# Altium schematic sheet POWER.SchDoc: POWER
size A4; Author: Gabriel; Organization: Altium Limited; Address1: L3, 12a Rodborough Rd; Address2: Frenchs Forest; Address3: NSW; Address4: Australia 2086; SheetNumber: 1; SheetTotal: 1; Subtitle: XDRONE
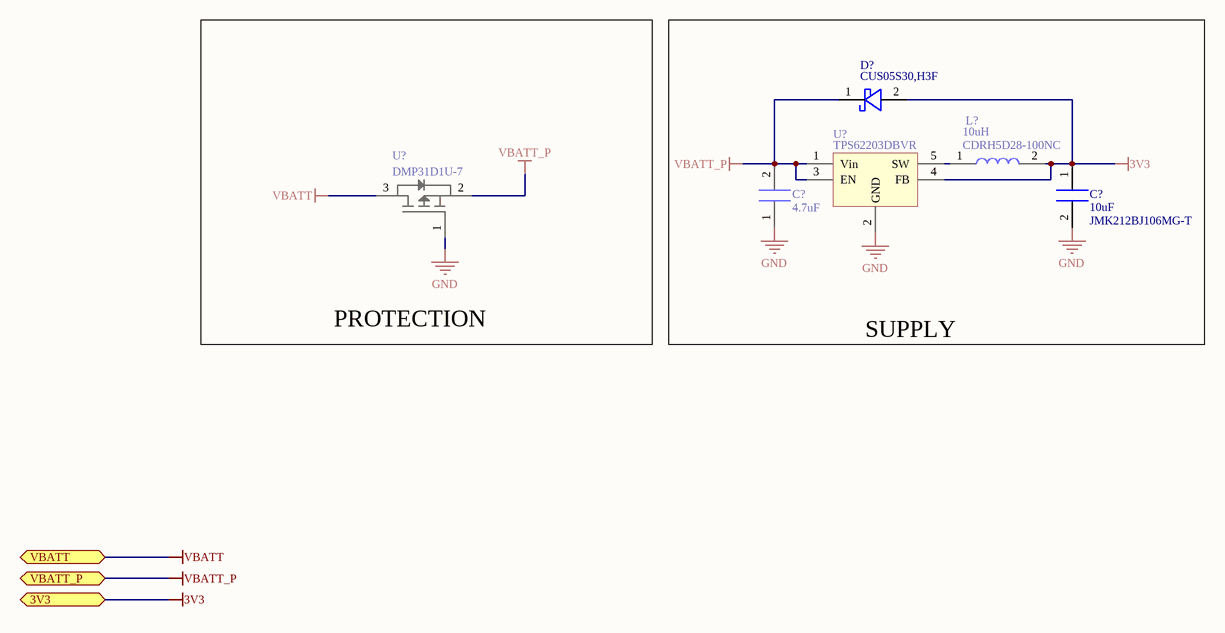
[diagram p0: POWER.SchDoc]

## Parts
(Parts that share a designator on the sheet are numbered #1, #2 ... from top to bottom, then left to right.)
C?#1  value 4.7uF  [CAP_0805]  (hidden comment: 4.7uF_10%_16V_0805_X7R_GRM21BR71C475KE51L)
C?#2  value 10uF  MANUFACTURER REFERENCE: JMK212BJ106MG-T  [CAP_0805]  (hidden comment: 10uF_20%_6.3V_0805_X5R_JMK212BJ106MG-T)
D?  MANUFACTURER REFERENCE: CUS05S30,H3F  [SOD-323]  (hidden comment: DIODE_30V_500mA_340mVf_CUS05S30,H3F)
L?  value 10uH  [CDRH5D28-100NC]  (hidden comment: 10uH_30%_1.3A_CDRH5D28-100NC)
U?#1  MANUFACTURER REFERENCE: TPS62203DBVR  [SC-74A-5 SOT-23-5]  (hidden comment: DCDC_6VIN_3.3VOUT_600mA_TPS62203DBVR)
U?#2  MANUFACTURER REFERENCE: DMP31D1U-7  [SOT-23]  (hidden comment: MOS_P_1G_30VDS_500mA_1.1Vth_DMP31D1U-7)

## Blocks framed on the sheet
PROTECTION: U?#2
SUPPLY: C?#1 C?#2 D? L? U?#1

## Ports
3V3, VBATT, VBATT_P

## Nets
3V3: C?#2.1 D?.2 L?.2 U?#1.4(FB) ; port 3V3
GND: C?#1.1 C?#2.2 U?#1.2(GND) U?#2.1
VBATT: U?#2.3 ; port VBATT
VBATT_P: C?#1.2 D?.1 U?#1.1(Vin) U?#1.3(EN) U?#2.2 ; port VBATT_P
NetL?_1: L?.1 U?#1.5(SW)

## Notes on the sheet
- TITLE:
- CREATED BY
- MODIFIED DATE
- PAGE
- /

## Library data of the parts
C?#1 = 4.7uF_10%_16V_0805_X7R_GRM21BR71C475KE51L: CAP 4.7uF 10% 106 0805 X7R; MANUFACTURER: MURATA; VOLTAGE RATING: 16V; DIELECTRIC: X7R; TOLERANCE: 10%; PACKAGING: 0805; MOUNTING: SMD; MANUFACTURER REFERENCE: GRM21BR71C475KE51L
C?#2 = 10uF_20%_6.3V_0805_X5R_JMK212BJ106MG-T: CAP 10uF 20% 6.3V 0805 X5R; MANUFACTURER: TAYIO YUDEN; DIELECTRIC: X5R; TOLERANCE: 20%; VOLTAGE RATING: 6.3V; PACKAGING: 0805; MOUNTING: SMD
D? = DIODE_30V_500mA_340mVf_CUS05S30,H3F: DIODE 30V 500mA 340mVf CUS05S30,H3F; MANUFACTURER: TOSHIBA; FORWARD VOLTAGE: 340mV; TYPE: SCHOTTKY; REVERSE VOLTAGE MAX: 30V; CURRENT MAX: 500mA; PACKAGING: SOD-323; MOUNTING: SMD
L? = 10uH_30%_1.3A_CDRH5D28-100NC: INDUCTOR 10uH 30% 1.3A CDRH5D28-100NC; MANUFACTURER: SUMIDA; TOLERANCE: 30%; MOUNTING: SMD; MANUFACTURER REFERENCE: CDRH5D28-100NC; CURRENT RATING: 1.3A
U?#1 = DCDC_5VIN_3.3VOUT_1A_TPS62203DBVR: DCDC 2-5Vin 3.3Vout 1A 300mA TPS62203DBVR; MANUFACTURER: TI; INPUT VOLTAGE MIN: 2.5V; INPUT VOLTAGE MAX: 6V; OUTPUT VOLTAGE: 3.3V; CURRENT MAX: 300mA; PACKAGING: SOT-23-5; MOUNTING: SMD
U?#2 = MOS_P_1G_30VDS_500mA_1.1Vth_DMP31D1U-7: MOS-P 1GATE 30VDS 500mA 1.1VTH DMP31D1U-7; MANUFACTURER: DIODES; VOLTAGE DS MAX: -30V; NUMBER OF GATES: 1; VOLTAGE THRESHOLD: -1.1V; CURRENT MAX: 500mA; PACKAGING: SOT-23; MOUNTING: SMD